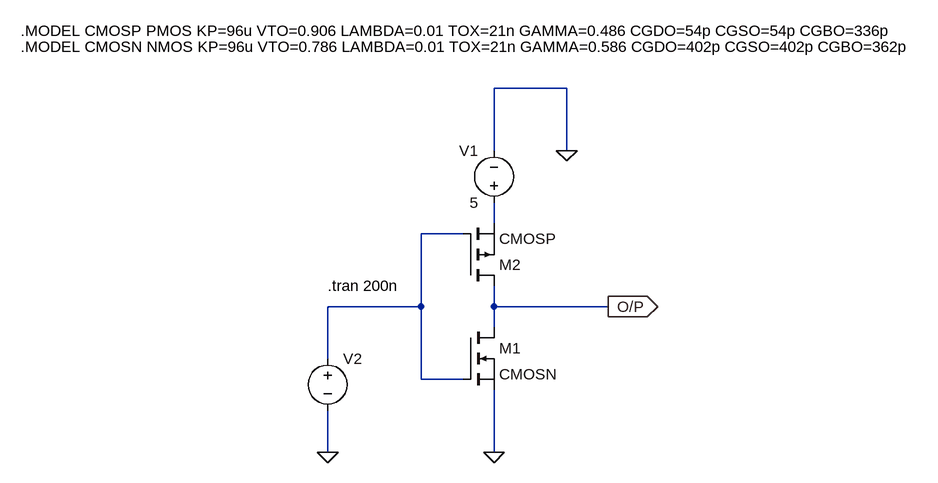
[diagram p0: schematic RealInverter.asc]
RealInverter.asc, the LTspice schematic file:
Version 4
SHEET 1 1088 680
WIRE 352 -176 240 -176
WIRE 240 -80 240 -176
WIRE 352 -80 352 -176
WIRE 240 32 240 0
WIRE 192 48 128 48
WIRE 128 160 128 48
WIRE 128 160 -16 160
WIRE 240 160 240 128
WIRE 416 160 240 160
WIRE 240 192 240 160
WIRE -16 240 -16 160
WIRE 128 272 128 160
WIRE 192 272 128 272
WIRE -16 384 -16 320
WIRE 240 384 240 288
FLAG -16 384 0
FLAG 352 -80 0
FLAG 240 384 0
FLAG 416 160 O/P
IOPIN 416 160 Out
SYMBOL nmos 192 192 R0
SYMATTR InstName M1
SYMATTR Value CMOSN
SYMBOL pmos 192 128 M180
SYMATTR InstName M2
SYMATTR Value CMOSP
SYMBOL voltage 240 16 R180
WINDOW 0 24 96 Left 2
WINDOW 3 24 16 Left 2
WINDOW 123 0 0 Left 0
WINDOW 39 0 0 Left 0
SYMATTR InstName V1
SYMATTR Value 5
SYMBOL voltage -16 224 R0
WINDOW 123 0 0 Left 0
WINDOW 39 0 0 Left 0
WINDOW 3 11 113 Invisible 2
SYMATTR Value PULSE(0 5 0 1p 1p 100n 200n 2)
SYMATTR InstName V2
TEXT -16 128 Left 2 !.tran 200n
TEXT -488 -264 Left 2 !.MODEL CMOSP PMOS KP=96u VTO=0.906 LAMBDA=0.01 TOX=21n GAMMA=0.486 CGDO=54p CGSO=54p CGBO=336p
TEXT -488 -240 Left 2 !.MODEL CMOSN NMOS KP=96u VTO=0.786 LAMBDA=0.01 TOX=21n GAMMA=0.586 CGDO=402p CGSO=402p CGBO=362p

The netlist it stands for:
* RealInverter.asc
M1 O/P N002 0 0 CMOSN
M2 O/P N002 N001 N001 CMOSP
V1 N001 0 5
V2 N002 0 PULSE(0 5 0 1p 1p 100n 200n 2)
.model NMOS NMOS
.model PMOS PMOS
.lib standard.mos
.tran 200n
.MODEL CMOSP PMOS KP=96u VTO=0.906 LAMBDA=0.01 TOX=21n GAMMA=0.486 CGDO=54p CGSO=54p CGBO=336p
.MODEL CMOSN NMOS KP=96u VTO=0.786 LAMBDA=0.01 TOX=21n GAMMA=0.586 CGDO=402p CGSO=402p CGBO=362p
.backanno
.end